# EAGLE design Solar USB (EAGLE 7.1.0)
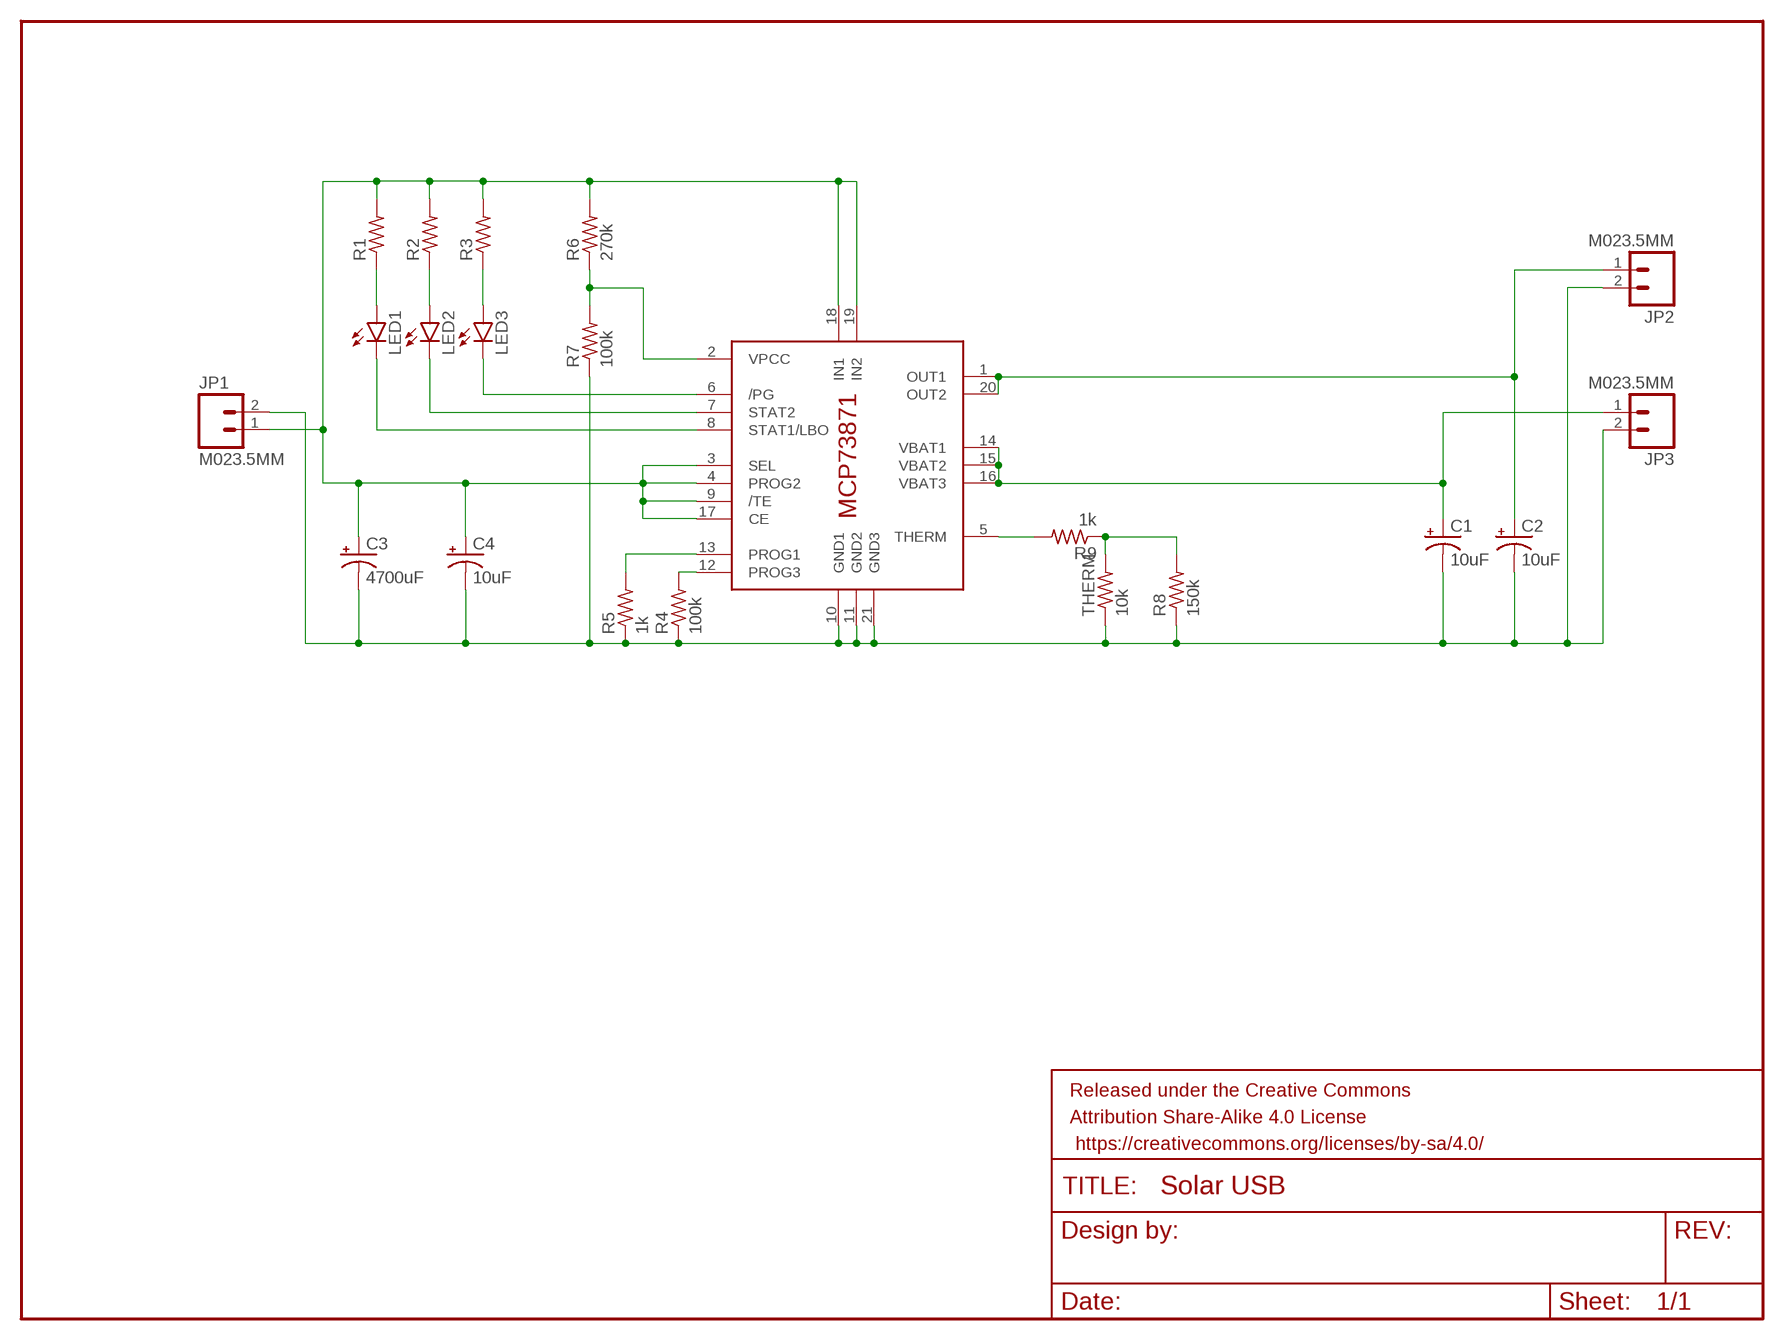
[diagram p0: schematic, sheet 1]

## Parts
C1  10uF  CPOL-USE2.5-5  [E2,5-5]
C2  10uF  CPOL-USE2.5-5  [E2,5-5]
C3  4700uF  CPOL-USE7.5-16  [E7,5-16]
C4  10uF  CPOL-USE2.5-5  [E2,5-5]
FRAME1  FRAME-LETTER  [CREATIVE_COMMONS]
IC1  MCP73871  [QFN20]
JP1  M023.5MM  [SCREWTERMINAL-3.5MM-2]
JP2  M023.5MM  [SCREWTERMINAL-3.5MM-2]
JP3  M023.5MM  [SCREWTERMINAL-3.5MM-2]
LED1  LED5MM  [LED5MM]
LED2  LED5MM  [LED5MM]
LED3  LED5MM  [LED5MM]
R1  R-US_0207/10  [0207/10]
R2  R-US_0207/10  [0207/10]
R3  R-US_0207/10  [0207/10]
R4  100k  R-US_0207/10  [0207/10]
R5  1k  R-US_0207/10  [0207/10]
R6  270k  R-US_0207/10  [0207/10]
R7  100k  R-US_0207/10  [0207/10]
R8  150k  R-US_0207/10  [0207/10]
R9  1k  R-US_0207/10  [0207/10]
THERM  10k  R-US_0207/10  [0207/10]

## Nets
N$1: IC1.6(/PG) LED3.K(C)
N$2: C1.- C2.- C3.- C4.- IC1.10(GND1) IC1.11(GND2) IC1.21(GND3) JP1.2 JP2.2 JP3.2 R4.1 R5.1 R7.1 R8.1 THERM.1
N$3: IC1.12(PROG3) R4.2
N$4: IC1.13(PROG1) R5.2
N$5: R8.2 R9.1 THERM.2
N$8: IC1.7(STAT2) LED2.K(C)
N$9: IC1.8(STAT1/LBO) LED1.K(C)
N$10: C3.+ C4.+ IC1.3(SEL) IC1.4(PROG2) IC1.9(/TE) IC1.17(CE) IC1.18(IN1) IC1.19(IN2) JP1.1 R1.2 R2.2 R3.2 R6.2
N$11: IC1.5(THERM) R9.2
N$12: LED1.A R1.1
N$13: LED2.A R2.1
N$14: LED3.A R3.1
N$15: C2.+ IC1.1(OUT1) IC1.20(OUT2) JP2.1
N$16: IC1.2(VPCC) R6.1 R7.2
N$17: C1.+ IC1.14(VBAT1) IC1.15(VBAT2) IC1.16(VBAT3) JP3.1

## Library data of the parts
C1-C4 = adafruit:CPOL-US: POLARIZED CAPACITOR, American symbol
FRAME1 = SparkFun-Aesthetics:FRAME-LETTER: Schematic Frame Standard 8.5x11 US Letter frame
IC1 = adafruit:MCP73871
JP1-JP3 = SparkFun-Connectors:M02: Standard 2-pin 0.1" header. Use with - straight break away headers ( PRT-00116) - right angle break away headers (PRT-00553) - swiss pins (PRT-00743) - machine pins (PRT-00117) - female headers (PRT-00115) Molex polarized connector foot print use with: PRT-08233 with associated crimp pins and housings. 2.54_SCREWTERM for use with PRT-10571. 3.5mm Screw Terminal footprints for PRT-08084 5mm Screw Terminal footprints for use with PRT-08432
LED1-LED3 = SparkFun-LED:LED: LEDs Standard schematic elements and footprints for 5mm, 3mm, 1206, and 0603 sized LEDs. 5mm - Spark Fun Electronics SKU : COM-00529 (and others)
R1-R9 THERM = adafruit:R-US_: RESISTOR, American symbol

## Board
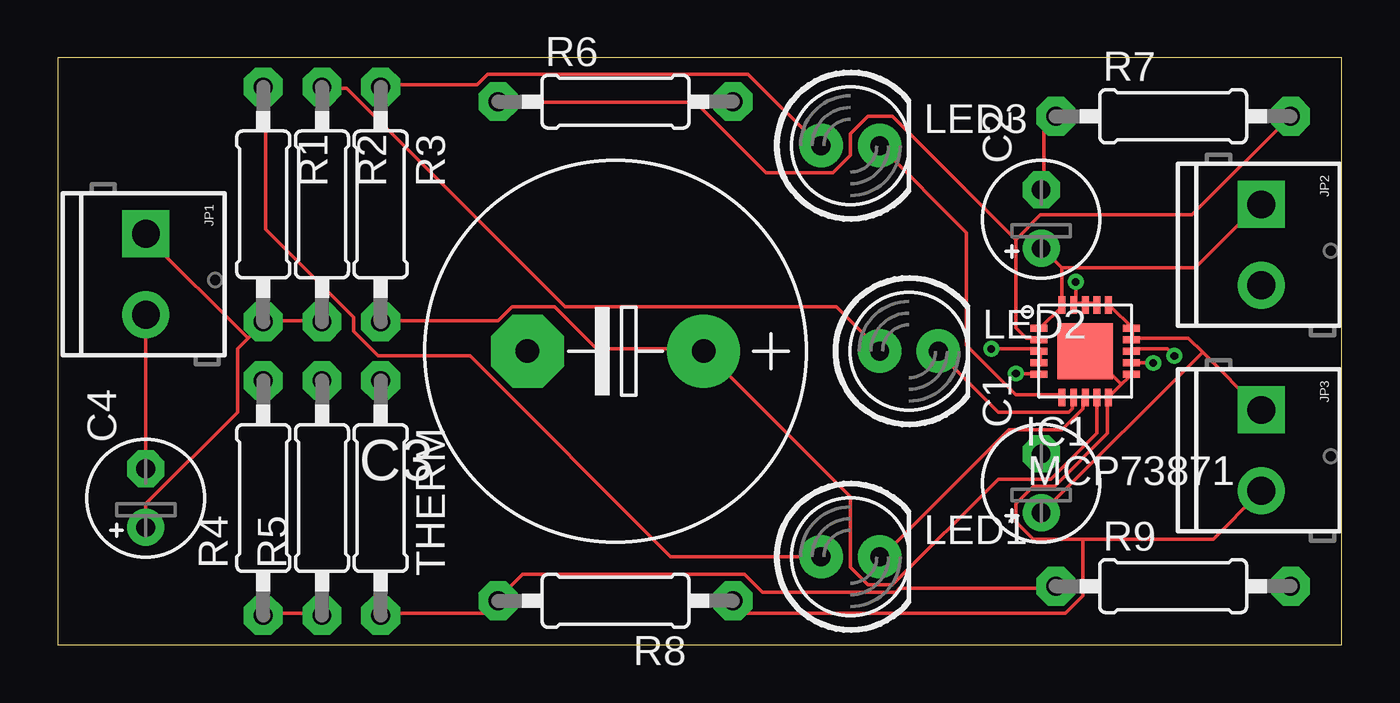
[diagram p1: board, top side]
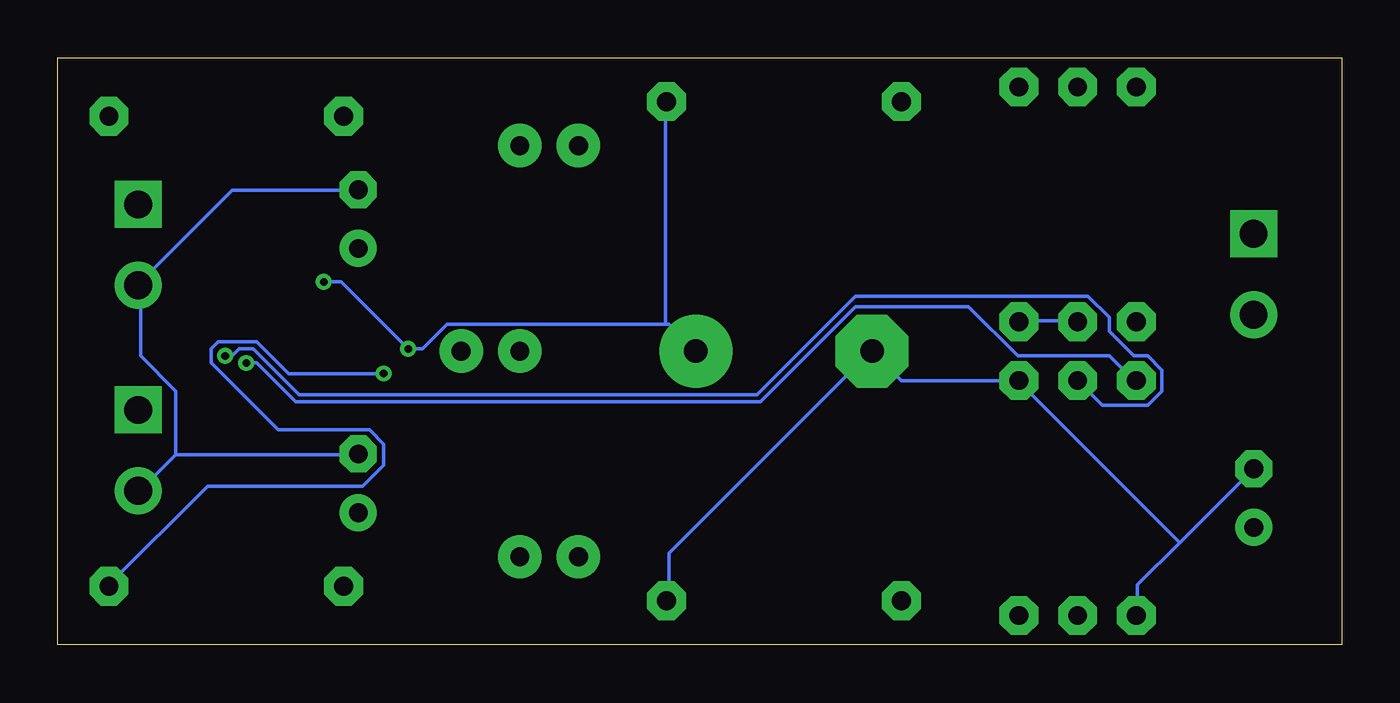
[diagram p2: board, bottom side, seen from below]

Size 55.55 x 25.39 mm. Coordinates in mm from the lower left corner, seen from the top.
Outline: 0,0 55.55,0 55.55,25.39 0,25.39 0,0
Copper layers (1*16): Top 0.0356mm / dielectric 1.5011mm / Bottom 0.0356mm
Design rules "LaenPCBOrder": minimum track width 6mil, minimum drill 13mil, track to track 6mil, track to pad 6mil, pad to pad 6mil, via to via 6mil, smd to smd 6mil, copper to edge 15mil, drill to drill 6mil, minimum pad ring 7mil, minimum via ring 7mil, stop-mask expansion 3mil, vias tented up to drill 0mil, thermal gap 10mil

### Footprints (pad centres in the part's own frame; a part is rotated, then mirrored left to right if it is on the bottom)
E2,5-5 = drill 0.813 pad 1.6: + -1.27,0 | drill 0.813 pad 1.6 octagon: - 1.27,0
E7,5-16 = drill 1.016 pad 3.15: + -3.81,0 | drill 1.016 pad 3.15 octagon: - 3.81,0
QFN20 = smd 0.75 x 0.3: 1 -2,1; 2 -2,0.5; 3 -2,0; 4 -2,-0.5; 5 -2,-1; 11 2,-1; 12 2,-0.5; 13 2,0; 14 2,0.5; 15 2,1 | smd 0.3 x 0.75: 6 -1,-2; 7 -0.5,-2; 8 0,-2; 9 0.5,-2; 10 1,-2; 16 1,2; 17 0.5,2; 18 0,2; 19 -0.5,2; 20 -1,2 | smd 2.413 x 2.413: 21 0,0
SCREWTERMINAL-3.5MM-2 = drill 1.2 pad 2.032 square: 1 0,0 | drill 1.2 pad 2.032: 2 3.5,0
LED5MM = drill 0.813 pad 1.88: A -1.27,0; K 1.27,0
0207/10 = drill 0.813 pad 1.676 octagon: 1 -5.08,0; 2 5.08,0

### Placement (x,y rotation side)
C1  42.55,6.99 90 top
C2  42.55,18.41 90 top
C3  24.13,12.7 180 top
C4  3.81,6.35 90 top
FRAME1  21.59,-20.32 0 top  (outside the outline)
IC1  44.45,12.7 0 top
JP1  3.81,17.78 270 top
JP2  52.07,19.05 270 top
JP3  52.07,10.16 270 top
LED1  34.29,3.81 0 top
LED2  36.83,12.7 0 top
LED3  34.29,21.59 0 top
R1  8.89,19.05 270 top
R2  11.43,19.05 270 top
R3  13.97,19.05 270 top
R4  8.89,6.35 90 top
R5  11.43,6.35 90 top
R6  24.13,23.5 0 top
R7  48.26,22.86 0 top
R8  24.13,1.91 180 top
R9  48.26,2.54 0 top
THERM  13.97,6.35 270 top

### Tracks (layer width: path | path; a pad name or v marks a point on that pad's centre or on a via)
N$1
  Top 0.152: LED3.K 39.32,17.83 39.32,12.95 41.45,10.82 43.43,10.82 IC1.6
N$2
  Top 0.152: C2.- 42.67,19.81 42.67,22.4 43.13,22.86 R7.1 | 46.02,11.28 46.33,11.58 IC1.11 | 46.02,11.28 45.57,10.82 IC1.10 45.41,10.67 45.41,9.14 43.13,6.86 42.22,6.86 41.45,6.1 41.45,5.33 42.22,4.57 44.35,4.57 | 46.02,11.28 44.5,12.8 IC1.21 | 44.35,4.57 49.99,4.57 51.97,6.55 JP3.2 | R4.1 8.99,1.37 11.43,1.37 R5.1 | JP1.2 C4.- | 44.35,4.57 44.35,2.13 43.59,1.37 29.72,1.37 29.26,1.83 R8.1
  Bottom 0.152: 50.44,8.23 42.67,8.23 C1.- | 50.44,8.23 51.97,6.71 JP3.2 | 50.44,8.23 50.44,10.97 51.97,12.5 51.97,15.54 JP2.2 51.97,15.7 48.01,19.66 42.67,19.66 C2.- | C4.- 7.01,4.42 | 7.01,4.42 8.84,2.59 8.84,1.37 R4.1 | R8.1 29.11,1.98 29.11,3.96 20.42,12.65 C3.- 19.05,11.43 14.02,11.43 | 14.02,11.43 7.01,4.42 | 14.02,11.43 THERM.1
N$3  (via drill 0.33)
  Top 0.152: v47.4,12.19 46.48,12.19 IC1.12
  Bottom 0.152: v47.4,12.19 46.94,12.19 45.26,10.52 25.15,10.52 21.03,14.63 16.15,14.63 14.02,12.5 10.06,12.5 8.99,11.43 R4.2
N$4  (via drill 0.33)
  Top 0.152: v48.31,12.5 48.01,12.8 46.48,12.8 IC1.13
  Bottom 0.152: v48.31,12.5 48.01,12.5 47.7,12.8 47.09,12.8 45.11,10.82 25.3,10.82 21.03,15.09 10.97,15.09 10.06,14.17 10.06,13.56 8.99,12.5 8.38,12.5 7.77,11.89 7.77,10.97 8.38,10.36 10.36,10.36 R5.2
N$5
  Top 0.152: THERM.2 14.02,1.37 18.59,1.37 19.05,1.83 R8.2 19.05,1.98 20.12,3.05 29.72,3.05 30.48,2.29 36.27,2.29 36.42,2.44 43.13,2.44 R9.1
N$8
  Top 0.152: IC1.7 43.89,10.67 43.89,10.21 43.74,10.06 40.69,10.06 38.1,12.65 LED2.K
N$9
  Top 0.152: IC1.8 44.35,10.67 44.35,10.21 43.43,9.3 41.15,9.3 35.66,3.81 LED1.K
N$10  (via drill 0.33)
  Top 0.152: C4.+ 3.81,6.1 7.77,10.06 7.77,12.8 8.23,13.26 | 8.23,13.26 8.84,13.87 R1.2 8.99,14.02 11.43,14.02 R2.2 | 8.23,13.26 3.81,17.68 JP1.1 | 44.04,14.78 44.35,14.78 IC1.18 44.5,14.78 44.81,14.78 IC1.17 | IC1.4 42.52,12.34 42.52,12.65 IC1.3 42.37,12.8 v40.39,12.8 | IC1.9 44.96,10.67 44.96,9.14 42.98,7.16 40.69,7.16 36.12,2.59 35.05,2.59 34.29,3.35 34.29,6.4 28.04,12.65 C3.+ 27.89,12.8 23.32,12.8 21.49,14.63 19.66,14.63 19.05,14.02 14.02,14.02 R3.2 | v44.04,15.7 44.04,14.78 | 44.04,14.78 IC1.19
  Bottom 0.152: R3.2 13.87,14.02 11.43,14.02 R2.2 | 29.26,13.87 29.11,13.87 C3.+ | 29.26,13.87 38.71,13.87 39.78,12.8 v40.39,12.8 43.28,15.7 v44.04,15.7 | 29.26,13.87 29.26,23.47 R6.2
N$11  (via drill 0.33)
  Top 0.152: v41.45,11.73 42.37,11.73 IC1.5
  Bottom 0.152: v41.45,11.73 45.57,11.73 46.94,13.11 48.62,13.11 48.92,12.8 48.92,12.19 46.02,9.3 42.06,9.3 41.45,8.69 41.45,7.77 42.37,6.86 49.07,6.86 53.34,2.59 R9.2
N$12
  Top 0.152: LED1.A 26.52,3.81 17.83,12.5 13.87,12.5 12.8,13.56 12.8,14.17 8.99,17.98 8.99,24.08 R1.1
N$13
  Top 0.152: R2.1 11.43,24.08 12.5,24.08 21.95,14.63 33.68,14.63 35.51,12.8 LED2.A
N$14
  Top 0.152: R3.1 14.02,24.23 18.14,24.23 18.59,24.69 29.87,24.69 32.92,21.64 LED3.A
N$15
  Top 0.152: IC1.1 42.52,13.72 43.43,14.63 IC1.20 43.43,14.78 43.43,16.31 | 43.43,16.31 42.67,17.07 C2.+ | 43.43,16.31 49.23,16.31 51.97,19.05 JP2.1
N$16
  Top 0.152: 41.45,17.53 41.45,13.72 41.91,13.26 42.37,13.26 IC1.2 | 41.45,17.53 42.52,18.59 49.07,18.59 R7.2 | 41.45,17.53 36.12,22.86 35.05,22.86 34.29,22.1 34.29,21.18 33.53,20.42 30.63,20.42 27.58,23.47 19.05,23.47 R6.1
N$17
  Top 0.152: 46.48,13.26 46.48,13.56 IC1.15 46.48,13.72 45.57,14.63 IC1.16 | 46.48,13.26 48.92,13.26 49.53,12.65 | 49.53,12.65 51.97,10.21 JP3.1 | 46.48,13.26 IC1.14 | 49.53,12.65 42.67,5.79 C1.+